# EAGLE schematic GeniusBottom (EAGLE 9.6.2)
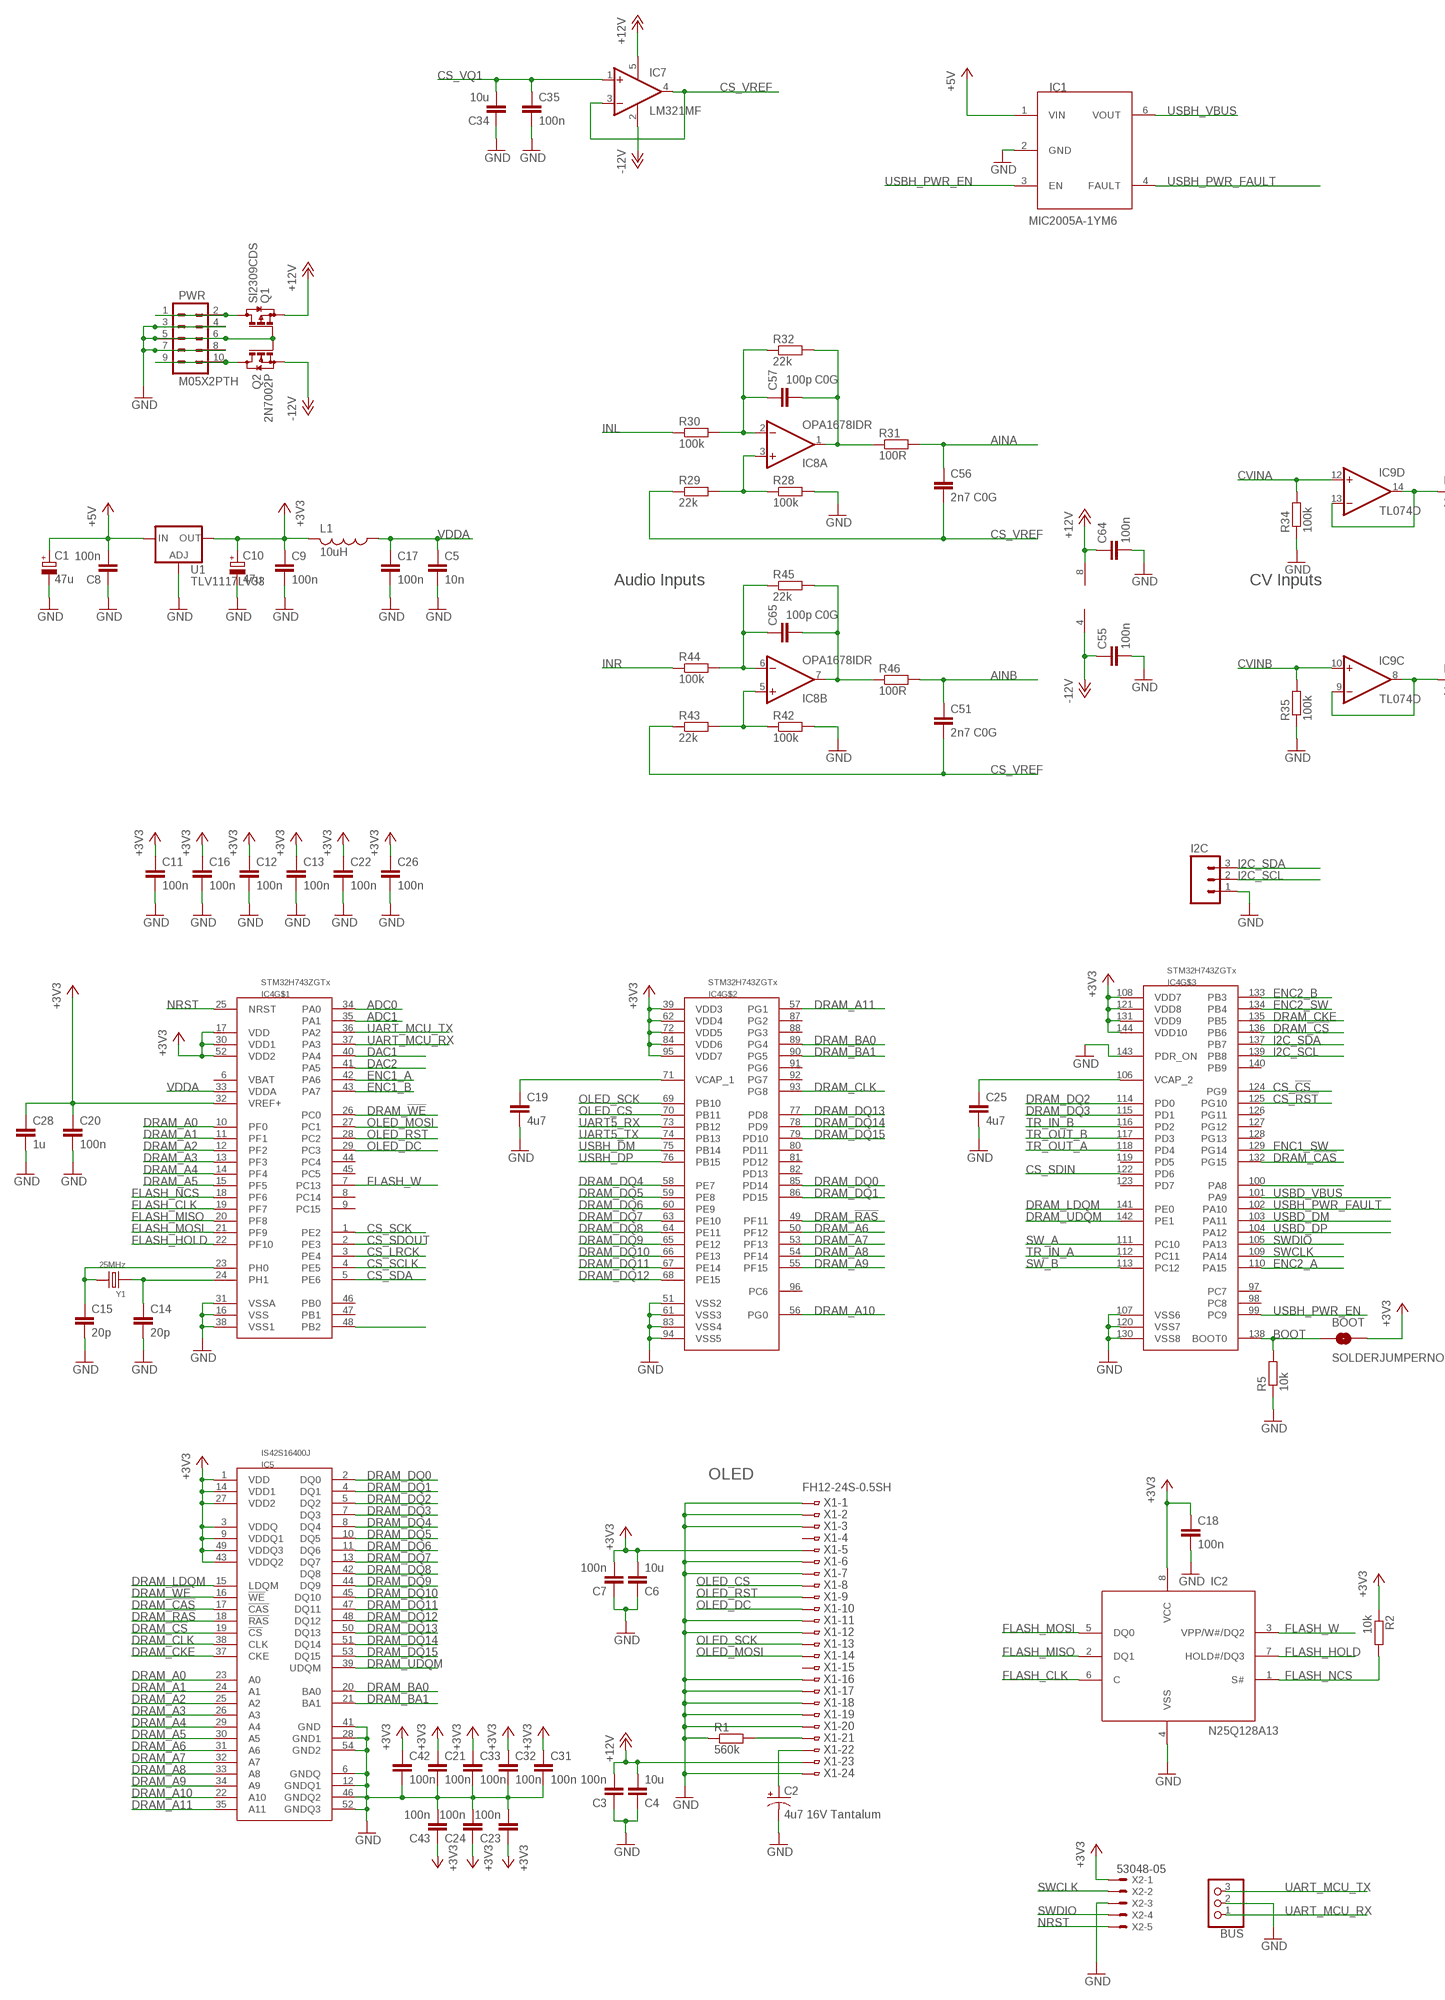
[diagram p0: schematic, sheet 1, part 1 of 2]
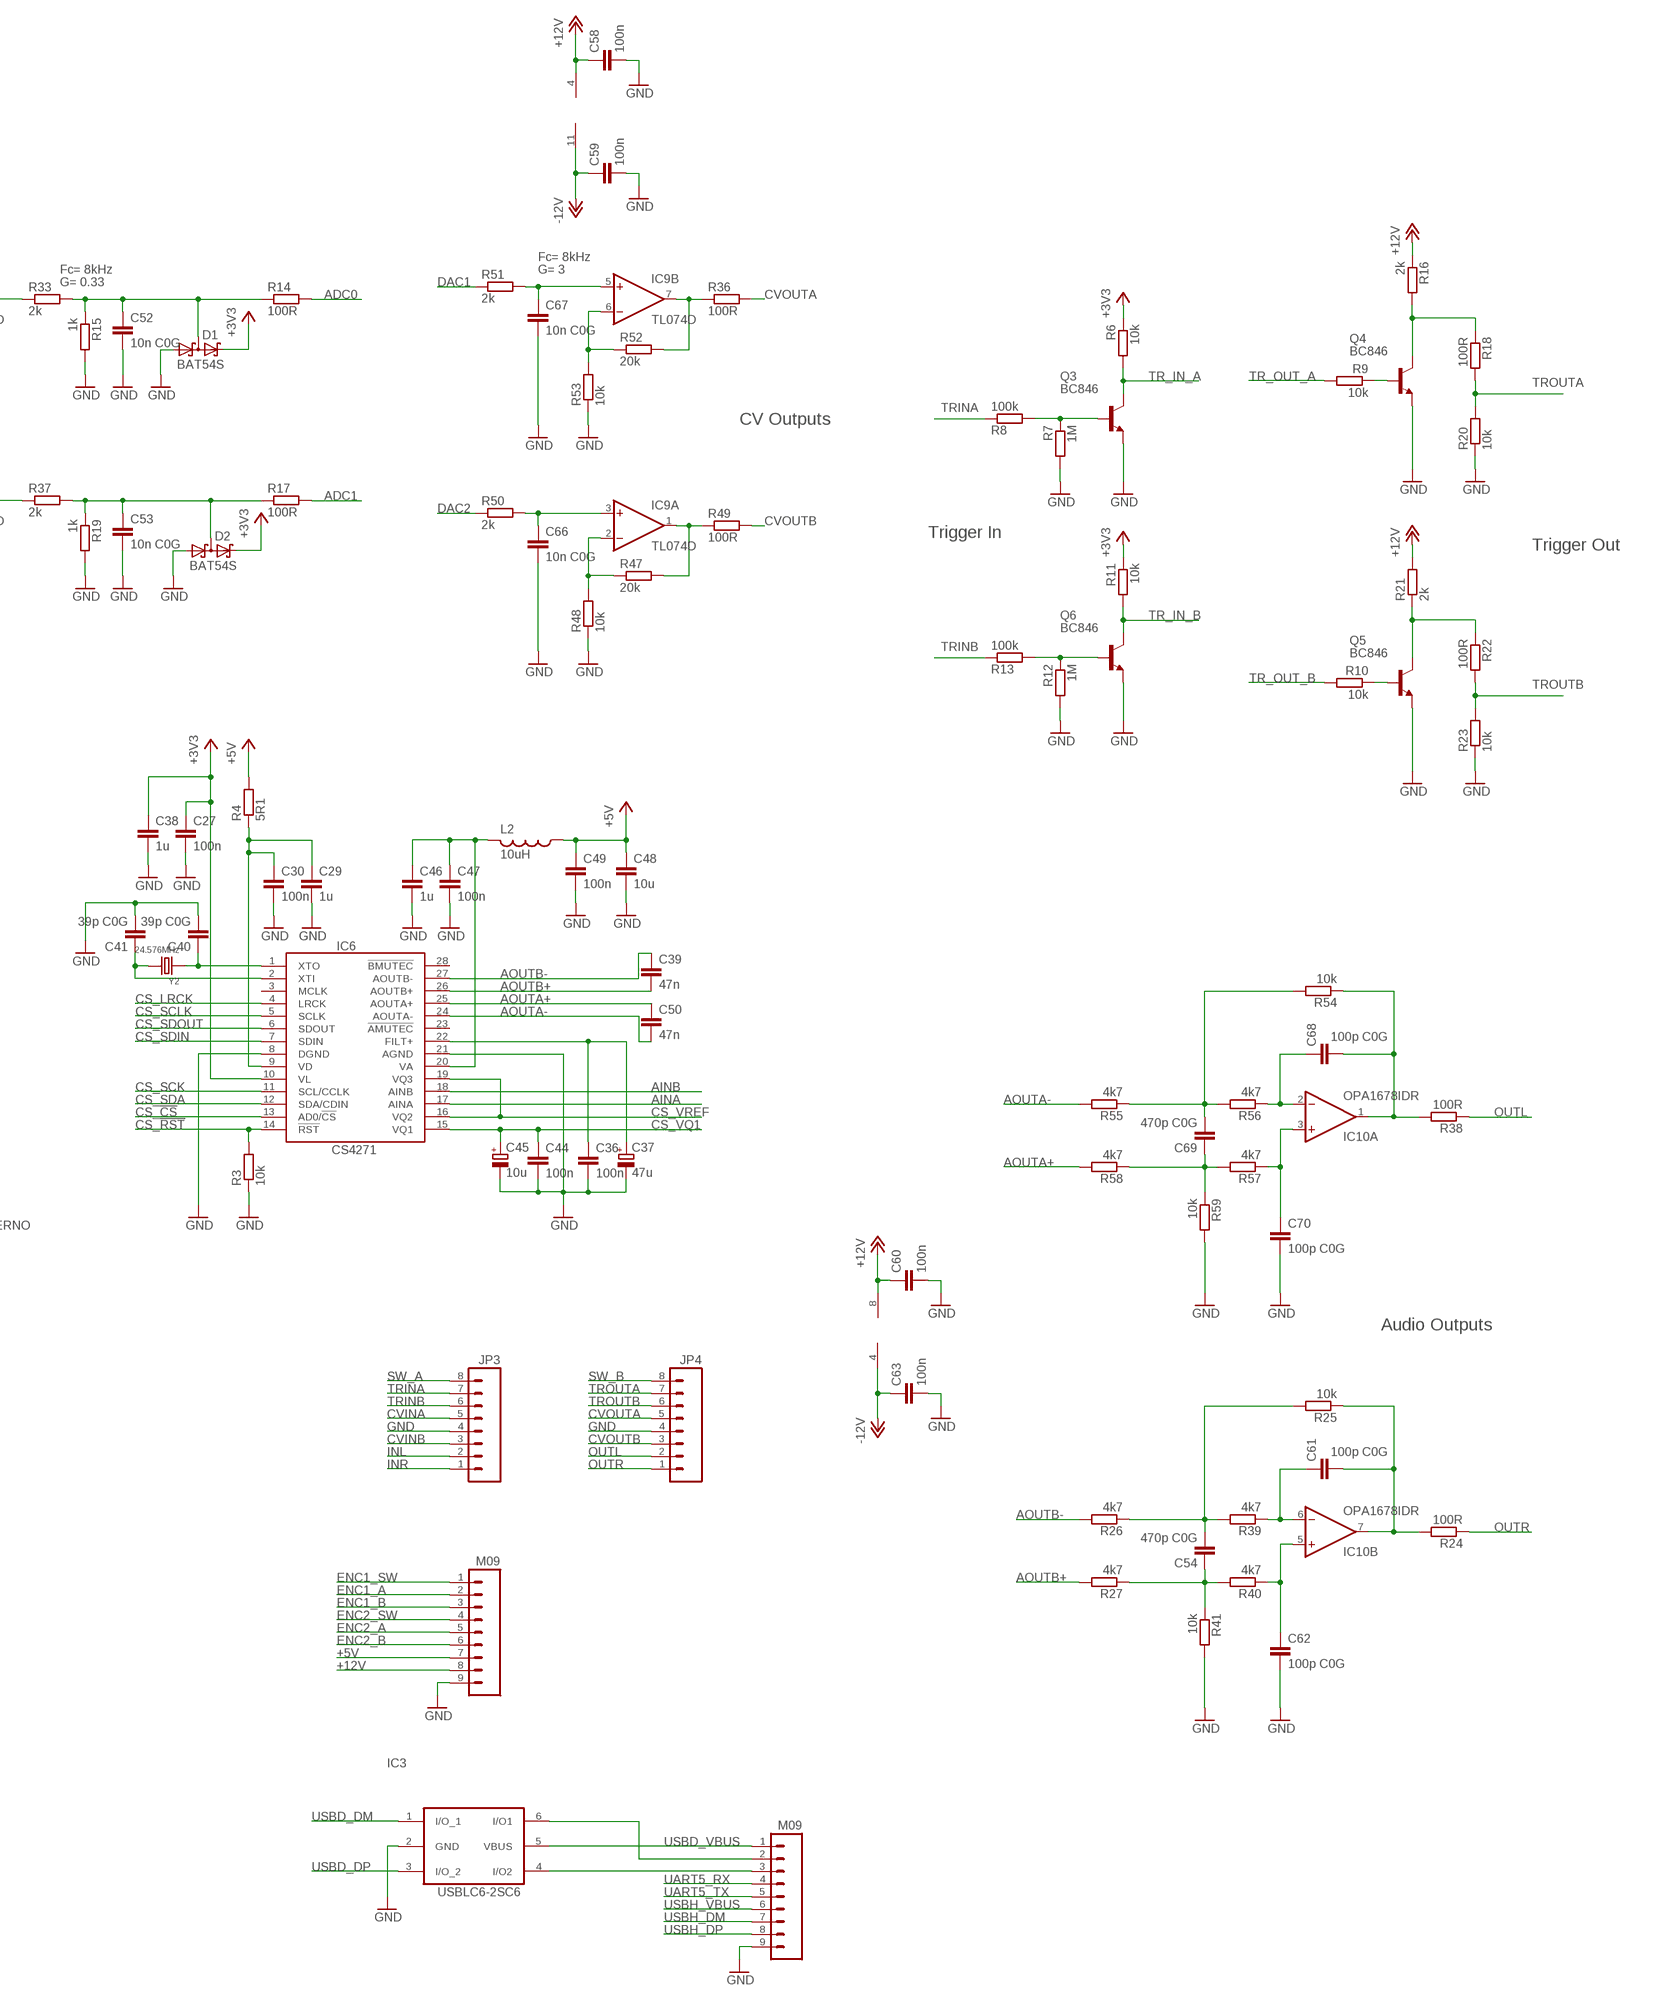
[diagram p1: schematic, sheet 1, part 2 of 2]

## Parts
BOOT  SOLDERJUMPERNO  [SJ_2S-NO]
BUS  CON-JST-1X03PH-TH  [JST-B3B-PH-KL]
C1  47u  CPOL-EU153CLV-0505  [CPOL-5]
C2  4u7 16V Tantalum  CAP_POL1206  [EIA3216]
C3  100n  C-EUC0603  [C0603]
C4  10u  C-EUC1206  [C1206]
C5  10n  C-EUC0603  [C0603]
C6  10u  C-EUC1206  [C1206]
C7  100n  C-EUC0603  [C0603]
C8  100n  C-EUC0603  [C0603]
C9  100n  C-EUC0603  [C0603]
C10  47u  CPOL-EU153CLV-0505  [CPOL-5]
C11  100n  C-EUC0603  [C0603]
C12  100n  C-EUC0603  [C0603]
C13  100n  C-EUC0603  [C0603]
C14  20p  C-EUC0603  [C0603]
C15  20p  C-EUC0603  [C0603]
C16  100n  C-EUC0603  [C0603]
C17  100n  C-EUC0603  [C0603]
C18  100n  C-EUC0603  [C0603]
C19  4u7  C-EUC0603  [C0603]
C20  100n  C-EUC0603  [C0603]
C21  100n  C-EUC0603  [C0603]
C22  100n  C-EUC0603  [C0603]
C23  100n  C-EUC0603  [C0603]
C24  100n  C-EUC0603  [C0603]
C25  4u7  C-EUC0603  [C0603]
C26  100n  C-EUC0603  [C0603]
C27  100n  C-EUC0603  [C0603]
C28  1u  C-EUC0603  [C0603]
C29  1u  C-EUC0603  [C0603]
C30  100n  C-EUC0603  [C0603]
C31  100n  C-EUC0603  [C0603]
C32  100n  C-EUC0603  [C0603]
C33  100n  C-EUC0603  [C0603]
C34  10u  C-EUC1206  [C1206]
C35  100n  C-EUC0603  [C0603]
C36  100n  C-EUC0603  [C0603]
C37  47u  CPOL-EU153CLV-0505  [CPOL-5]
C38  1u  C-EUC0603  [C0603]
C39  47n  C-EUC0603  [C0603]
C40  39p C0G  C-EUC0603  [C0603]
C41  39p C0G  C-EUC0603  [C0603]
C42  100n  C-EUC0603  [C0603]
C43  100n  C-EUC0603  [C0603]
C44  100n  C-EUC0603  [C0603]
C45  10u  CPOL-EU153CLV-0505  [CPOL-5]
C46  1u  C-EUC0603  [C0603]
C47  100n  C-EUC0603  [C0603]
C48  10u  C-EUC1206  [C1206]
C49  100n  C-EUC0603  [C0603]
C50  47n  C-EUC0603  [C0603]
C51  2n7 C0G  C-EUC0603  [C0603]
C52  10n C0G  C-EUC0603  [C0603]
C53  10n C0G  C-EUC0603  [C0603]
C54  470p C0G  C-EUC0603  [C0603]
C55  100n  C-EUC0603  [C0603]
C56  2n7 C0G  C-EUC0603  [C0603]
C57  100p C0G  C-EUC0603  [C0603]
C58  100n  C-EUC0603  [C0603]
C59  100n  C-EUC0603  [C0603]
C60  100n  C-EUC0603  [C0603]
C61  100p C0G  C-EUC0603  [C0603]
C62  100p C0G  C-EUC0603  [C0603]
C63  100n  C-EUC0603  [C0603]
C64  100n  C-EUC0603  [C0603]
C65  100p C0G  C-EUC0603  [C0603]
C66  10n C0G  C-EUC0603  [C0603]
C67  10n C0G  C-EUC0603  [C0603]
C68  100p C0G  C-EUC0603  [C0603]
C69  470p C0G  C-EUC0603  [C0603]
C70  100p C0G  C-EUC0603  [C0603]
D1  BAT54S  [SOT23]
D2  BAT54S  [SOT23]
I2C  M03PTH  [1X03]
IC1  MIC2005A-1YM6  MIC2005  [SOT23-6]
IC2  N25Q128A13  [SO8W]
IC3  USBLC6-2SC6  [SOT-23-6L]
IC4  STM32H743ZGTx  STM32F42XZ/43XZ(144PIN)LQFP144  [QFP50P2200X2200X160-144N]
IC5  IS42S16400J  [TSOP54-400]
IC6  CS4271  [TSSOP28-0.65-9.7X4.4MM]
IC7  LM321MF  [SOT23-5]
IC8  OPA1678IDR  NE5532D  [SO08]
IC9  TL074D  [SO14]
IC10  OPA1678IDR  NE5532D  [SO08]
JP1  M09  [1X09]
JP2  M09  [1X09]
JP3  M081X08  [1X08]
JP4  M081X08  [1X08]
L1  10uH  INDUCTOR  [0603]
L2  10uH  INDUCTOR  [0603]
PWR  M05X2PTH  [AVR_ICSP]
Q1  SI2309CDS  BSS84  [SOT23]
Q2  2N7002P  BSS123  [SOT23]
Q3  BC846  [SOT23]
Q4  BC846  [SOT23]
Q5  BC846  [SOT23]
Q6  BC846  [SOT23]
R1  560k  R-EU_0603  [0603]
R2  10k  R-EU_0603  [0603]
R3  10k  R-EU_0603  [0603]
R4  5R1  R-EU_0603  [0603]
R5  10k  R-EU_0603  [0603]
R6  10k  R-EU_0603  [0603]
R7  1M  R-EU_0603  [0603]
R8  100k  R-EU_0603  [0603]
R9  10k  R-EU_0603  [0603]
R10  10k  R-EU_0603  [0603]
R11  10k  R-EU_0603  [0603]
R12  1M  R-EU_0603  [0603]
R13  100k  R-EU_0603  [0603]
R14  100R  R-EU_0603  [0603]
R15  1k  R-EU_0603  [0603]
R16  2k  R-EU_0603  [0603]
R17  100R  R-EU_0603  [0603]
R18  100R  R-EU_0603  [0603]
R19  1k  R-EU_0603  [0603]
R20  10k  R-EU_0603  [0603]
R21  2k  R-EU_0603  [0603]
R22  100R  R-EU_0603  [0603]
R23  10k  R-EU_0603  [0603]
R24  100R  R-EU_0603  [0603]
R25  10k  R-EU_0603  [0603]
R26  4k7  R-EU_0603  [0603]
R27  4k7  R-EU_0603  [0603]
R28  100k  R-EU_0603  [0603]
R29  22k  R-EU_0603  [0603]
R30  100k  R-EU_0603  [0603]
R31  100R  R-EU_0603  [0603]
R32  22k  R-EU_0603  [0603]
R33  2k  R-EU_0603  [0603]
R34  100k  R-EU_0603  [0603]
R35  100k  R-EU_0603  [0603]
R36  100R  R-EU_0603  [0603]
R37  2k  R-EU_0603  [0603]
R38  100R  R-EU_0603  [0603]
R39  4k7  R-EU_0603  [0603]
R40  4k7  R-EU_0603  [0603]
R41  10k  R-EU_0603  [0603]
R42  100k  R-EU_0603  [0603]
R43  22k  R-EU_0603  [0603]
R44  100k  R-EU_0603  [0603]
R45  22k  R-EU_0603  [0603]
R46  100R  R-EU_0603  [0603]
R47  20k  R-EU_0603  [0603]
R48  10k  R-EU_0603  [0603]
R49  100R  R-EU_0603  [0603]
R50  2k  R-EU_0603  [0603]
R51  2k  R-EU_0603  [0603]
R52  20k  R-EU_0603  [0603]
R53  10k  R-EU_0603  [0603]
R54  10k  R-EU_0603  [0603]
R55  4k7  R-EU_0603  [0603]
R56  4k7  R-EU_0603  [0603]
R57  4k7  R-EU_0603  [0603]
R58  4k7  R-EU_0603  [0603]
R59  10k  R-EU_0603  [0603]
U1  TLV1117LV33  LD117AS33TR  [SOT223]
X1  FH12-24S-0.5SH  [FH12-24S-0.5SH]
X2  53048-05  [53048-05]
Y1  25MHz  SMD-CRYSTAL-8MHZ-20PF-20PPM(2P-5.0X3.2MM)  [X2-SMD-5.0X3.2X1.3MM]
Y2  24.576MHz  SMD-CRYSTAL-8MHZ-20PF-20PPM(2P-5.0X3.2MM)  [X2-SMD-5.0X3.2X1.3MM]

## Nets
+3.3V [power]: BOOT.2 C6.2 C7.2 C9.1 C10.+ C11.1 C12.1 C13.1 C16.1 C18.1 C20.1 C21.1 C22.1 C23.1 C24.1 C26.1 C27.1 C28.1 C31.1 C32.1 C33.1 C38.1 C42.1 C43.1 D1.2(C2) D2.2(C2) IC2.8(VCC) IC4.17(VDD) IC4.30(VDD1) IC4.32(VREF+) IC4.39(VDD3) IC4.52(VDD2) IC4.62(VDD4) IC4.72(VDD5) IC4.84(VDD6) IC4.95(VDD7) IC4.108(VDD7) IC4.121(VDD8) IC4.131(VDD9) IC4.144(VDD10) IC5.1(VDD) IC5.3(VDDQ) IC5.9(VDDQ1) IC5.14(VDD1) IC5.27(VDD2) IC5.43(VDDQ2) IC5.49(VDDQ3) IC6.10(VL) L1.2 R2.1 R6.1 R11.1 U1.4(OUT) X1.5 X2.1 ; supply symbol labelled +3V3
+5V [power]: C1.+ C8.2 C48.1 C49.1 IC1.1(VIN) JP2.7 L2.1 R4.2 U1.3(IN)
+12V: C3.2 C4.2 C58.1 C60.1 C64.1 IC7.5(V+) IC8.8(P:V+) IC9.4(P:V+) IC10.8(P:V+) JP2.8 Q1.2(S) R16.1 R21.2 X1.23
-12V: C55.1 C59.1 C63.1 IC7.2(V-) IC8.4(P:V-) IC9.11(P:V-) IC10.4(P:V-) Q2.2(S)
ADC0: IC4.34(PA0) R14.2
ADC1: IC4.35(PA1) R17.2
AINA: C56.1 IC6.17(AINA) R31.2
AINB: C51.1 IC6.18(AINB) R46.2
ANALOG_OUTA: C68.2 IC10.1(A:OUT) R38.2 R54.1
ANALOG_OUTB: C61.2 IC10.7(B:OUT) R24.2 R25.1
AOUTA+: C50.1 IC6.25(AOUTA+) R58.2
AOUTA-: C50.2 IC6.24(AOUTA-) R55.2
AOUTB+: C39.2 IC6.26(AOUTB+) R27.2
AOUTB-: C39.1 IC6.27(AOUTB-) R26.2
BOOT: BOOT.1 IC4.138(BOOT0) R5.2
CS_!CS: IC4.124(PG9) IC6.13(AD0/!CS)
CS_!RST: IC4.125(PG10) IC6.14(!RST) R3.2
CS_LRCK: IC4.3(PE4) IC6.4(LRCK)
CS_SCK: IC4.1(PE2) IC6.11(SCL/CCLK)
CS_SCLK: IC4.4(PE5) IC6.5(SCLK)
CS_SDA: IC4.5(PE6) IC6.12(SDA/CDIN)
CS_SDIN: IC4.122(PD6) IC6.7(SDIN)
CS_SDOUT: IC4.2(PE3) IC6.6(SDOUT)
CS_VQ1: C34.2 C35.1 C44.1 C45.+ IC6.15(VQ1) IC7.1(+IN)
CS_VREF: C51.2 C56.2 IC6.16(VQ2) IC6.19(VQ3) IC7.3(-IN) IC7.4(OUT) R29.1 R43.1
CVINA: IC9.12(D:+IN) JP3.5 R34.2
CVINB: IC9.10(C:+IN) JP3.3 R35.2
CVOUTA: JP4.5 R36.2
CVOUTB: JP4.3 R49.2
DAC1: IC4.40(PA4) R51.1
DAC2: IC4.41(PA5) R50.1
DRAM_!CAS: IC4.132(PG15) IC5.17(!CAS)
DRAM_!CS: IC4.136(PB6) IC5.19(!CS)
DRAM_!RAS: IC4.49(PF11) IC5.18(!RAS)
DRAM_!WE: IC4.26(PC0) IC5.16(!WE)
DRAM_A0: IC4.10(PF0) IC5.23(A0)
DRAM_A1: IC4.11(PF1) IC5.24(A1)
DRAM_A2: IC4.12(PF2) IC5.25(A2)
DRAM_A3: IC4.13(PF3) IC5.26(A3)
DRAM_A4: IC4.14(PF4) IC5.29(A4)
DRAM_A5: IC4.15(PF5) IC5.30(A5)
DRAM_A6: IC4.50(PF12) IC5.31(A6)
DRAM_A7: IC4.53(PF13) IC5.32(A7)
DRAM_A8: IC4.54(PF14) IC5.33(A8)
DRAM_A9: IC4.55(PF15) IC5.34(A9)
DRAM_A10: IC4.56(PG0) IC5.22(A10)
DRAM_A11: IC4.57(PG1) IC5.35(A11)
DRAM_BA0: IC4.89(PG4) IC5.20(BA0)
DRAM_BA1: IC4.90(PG5) IC5.21(BA1)
DRAM_CKE: IC4.135(PB5) IC5.37(CKE)
DRAM_CLK: IC4.93(PG8) IC5.38(CLK)
DRAM_DQ0: IC4.85(PD14) IC5.2(DQ0)
DRAM_DQ1: IC4.86(PD15) IC5.4(DQ1)
DRAM_DQ2: IC4.114(PD0) IC5.5(DQ2)
DRAM_DQ3: IC4.115(PD1) IC5.7(DQ3)
DRAM_DQ4: IC4.58(PE7) IC5.8(DQ4)
DRAM_DQ5: IC4.59(PE8) IC5.10(DQ5)
DRAM_DQ6: IC4.60(PE9) IC5.11(DQ6)
DRAM_DQ7: IC4.63(PE10) IC5.13(DQ7)
DRAM_DQ8: IC4.64(PE11) IC5.42(DQ8)
DRAM_DQ9: IC4.65(PE12) IC5.44(DQ9)
DRAM_DQ10: IC4.66(PE13) IC5.45(DQ10)
DRAM_DQ11: IC4.67(PE14) IC5.47(DQ11)
DRAM_DQ12: IC4.68(PE15) IC5.48(DQ12)
DRAM_DQ13: IC4.77(PD8) IC5.50(DQ13)
DRAM_DQ14: IC4.78(PD9) IC5.51(DQ14)
DRAM_DQ15: IC4.79(PD10) IC5.53(DQ15)
DRAM_LDQM: IC4.141(PE0) IC5.15(LDQM)
DRAM_UDQM: IC4.142(PE1) IC5.39(UDQM)
ENC1_A: IC4.42(PA6) JP2.2
ENC1_B: IC4.43(PA7) JP2.3
ENC1_SW: IC4.129(PG14) JP2.1
ENC2_A: IC4.110(PA15) JP2.5
ENC2_B: IC4.133(PB3) JP2.6
ENC2_SW: IC4.134(PB4) JP2.4
FLASH_CLK: IC2.6(C) IC4.19(PF7)
FLASH_HOLD: IC2.7(HOLD#/DQ3) IC4.22(PF10)
FLASH_MISO: IC2.2(DQ1) IC4.20(PF8)
FLASH_MOSI: IC2.5(DQ0) IC4.21(PF9)
FLASH_NCS: IC2.1(S#) IC4.18(PF6) R2.2
FLASH_W: IC2.3(VPP/W#/DQ2) IC4.7(PC13)
GND: BUS.2 C1.- C2.C(-) C3.1 C4.1 C5.2 C6.1 C7.1 C8.1 C9.2 C10.- C11.2 C12.2 C13.2 C14.2 C15.2 C16.2 C17.2 C18.2 C19.2 C20.2 C21.2 C22.2 C23.2 C24.2 C25.2 C26.2 C27.2 C28.2 C29.2 C30.2 C31.2 C32.2 C33.2 C34.1 C35.2 C36.2 C37.- C38.2 C40.2 C41.2 C42.2 C43.2 C44.2 C45.- C46.2 C47.2 C48.2 C49.2 C52.2 C53.2 C55.2 C58.2 C59.2 C60.2 C62.2 C63.2 C64.2 C66.2 C67.2 C70.2 D1.1(A1) D2.1(A1) I2C.1 IC1.2(GND) IC2.4(VSS) IC3.2(GND) IC4.16(VSS) IC4.31(VSSA) IC4.38(VSS1) IC4.51(VSS2) IC4.61(VSS3) IC4.83(VSS4) IC4.94(VSS5) IC4.107(VSS6) IC4.120(VSS7) IC4.130(VSS8) IC4.143(PDR_ON) IC5.6(GNDQ) IC5.12(GNDQ1) IC5.28(GND1) IC5.41(GND) IC5.46(GNDQ2) IC5.52(GNDQ3) IC5.54(GND2) IC6.8(DGND) IC6.21(AGND) JP1.9 JP2.9 JP3.4 JP4.4 PWR.3 PWR.4 PWR.5 PWR.6 PWR.7 PWR.8 Q1.1(G) Q2.1(G) Q3.2(E) Q4.2(E) Q5.2(E) Q6.2(E) R1.1 R3.1 R5.1 R7.2 R12.2 R15.2 R19.2 R20.1 R23.1 R28.2 R34.1 R35.1 R41.2 R42.2 R48.1 R53.1 R59.2 U1.1(ADJ) X1.1 X1.2 X1.3 X1.6 X1.7 X1.11 X1.12 X1.16 X1.17 X1.18 X1.19 X1.20 X1.24 X2.3
I2C_SCL: I2C.2 IC4.139(PB8)
I2C_SDA: I2C.3 IC4.137(PB7)
INL: JP3.2 R30.1
INR: JP3.1 R44.1
N$1: C69.1 R57.2 R58.1 R59.1
N$2: C52.1 D1.3(C1A2) R14.1 R15.1 R33.2
N$3: C46.1 C47.1 IC6.20(VA) L2.2
N$4: IC9.7(B:OUT) R36.1 R52.2
N$5: IC9.8(C:OUT) IC9.9(C:-IN) R37.1
N$6: C2.A(+) X1.22
N$7: PWR.9 PWR.10 Q2.3(D)
N$8: R1.2 X1.21
N$9: PWR.1 PWR.2 Q1.3(D)
N$10: C69.2 R54.2 R55.1 R56.2
N$11: C14.1 IC4.24(PH1) Y1.1
N$12: IC9.2(A:-IN) R47.1 R48.2
N$13: C68.1 IC10.2(A:-IN) R56.1
N$14: C70.1 IC10.3(A:+IN) R57.1
N$15: IC9.6(B:-IN) R52.1 R53.2
N$17: C15.1 IC4.23(PH0) Y1.2
N$18: C40.1 IC6.1(XTO) Y2.1
N$19: IC3.6(I/O1) JP1.2
N$20: C36.1 C37.+ IC6.22(FILT+)
N$21: C41.1 IC6.2(XTI) Y2.2
N$22: C53.1 D2.3(C1A2) R17.1 R19.1 R37.2
N$25: C54.1 R27.1 R40.2 R41.1
N$26: C54.2 R25.2 R26.1 R39.2
N$27: C61.1 IC10.6(B:-IN) R39.1
N$28: C62.1 IC10.5(B:+IN) R40.1
N$30: IC9.13(D:-IN) IC9.14(D:OUT) R33.1
N$31: C66.1 IC9.3(A:+IN) R50.2
N$32: IC9.1(A:OUT) R47.2 R49.1
N$33: C25.1 IC4.106(VCAP_2)
N$34: C19.1 IC4.71(VCAP_1)
N$36: IC8.3(A:+IN) R28.1 R29.2
N$37: Q6.1(B) R12.1 R13.2
N$38: C57.1 IC8.2(A:-IN) R30.2 R32.1
N$39: Q5.1(B) R10.1
N$40: C57.2 IC8.1(A:OUT) R31.1 R32.2
N$41: Q5.3(C) R21.1 R22.1
N$42: IC8.5(B:+IN) R42.1 R43.2
N$43: C65.1 IC8.6(B:-IN) R44.2 R45.1
N$44: C67.1 IC9.5(B:+IN) R51.2
N$45: C65.2 IC8.7(B:OUT) R45.2 R46.1
N$46: IC4.48(PB2)
N$47: Q4.1(B) R9.1
N$48: IC4.100(PA8)
N$51: Q4.3(C) R16.2 R18.1
N$54: Q3.1(B) R7.1 R8.2
N$55: IC3.4(I/O2) JP1.3
NRST: IC4.25(NRST) X2.5
OLED_CS: IC4.70(PB11) X1.8
OLED_DC: IC4.29(PC3) X1.10
OLED_MOSI: IC4.27(PC1) X1.14
OLED_RST: IC4.28(PC2) X1.9
OLED_SCK: IC4.69(PB10) X1.13
OUTL: JP4.2 R38.1
OUTR: JP4.1 R24.1
SW_A: IC4.111(PC10) JP3.8
SW_B: IC4.113(PC12) JP4.8
SWCLK: IC4.109(PA14) X2.2
SWDIO: IC4.105(PA13) X2.4
TR_IN_A: IC4.112(PC11) Q3.3(C) R6.2
TR_IN_B: IC4.116(PD2) Q6.3(C) R11.2
TR_OUT_A: IC4.118(PD4) R9.2
TR_OUT_B: IC4.117(PD3) R10.2
TRINA: JP3.7 R8.1
TRINB: JP3.6 R13.1
TROUTA: JP4.7 R18.2 R20.2
TROUTB: JP4.6 R22.2 R23.2
UART5_RX: IC4.73(PB12) JP1.4
UART5_TX: IC4.74(PB13) JP1.5
UART_MCU_RX: BUS.1 IC4.37(PA3)
UART_MCU_TX: BUS.3 IC4.36(PA2)
USBD_DM: IC3.1(I/O_1) IC4.103(PA11)
USBD_DP: IC3.3(I/O_2) IC4.104(PA12)
USBD_VBUS: IC3.5(VBUS) IC4.101(PA9) JP1.1
USBH_DM: IC4.75(PB14) JP1.7
USBH_DP: IC4.76(PB15) JP1.8
USBH_PWR_EN: IC1.3(EN) IC4.99(PC9)
USBH_PWR_FAULT: IC1.4(FAULT) IC4.102(PA10)
USBH_VBUS: IC1.6(VOUT) JP1.6
VD: C29.1 C30.1 IC6.9(VD) R4.1
VDDA: C5.1 C17.1 IC4.33(VDDA) L1.1
Unconnected: IC4.6(VBAT) IC4.8(PC14) IC4.9(PC15) IC4.44(PC4) IC4.45(PC5) IC4.46(PB0) IC4.47(PB1) IC4.80(PD11) IC4.81(PD12) IC4.82(PD13) IC4.87(PG2) IC4.88(PG3) IC4.91(PG6) IC4.92(PG7) IC4.96(PC6) IC4.97(PC7) IC4.98(PC8) IC4.119(PD5) IC4.123(PD7) IC4.126(PG11) IC4.127(PG12) IC4.128(PG13) IC4.140(PB9) IC6.3(MCLK) IC6.23(!AMUTEC) IC6.28(!BMUTEC) X1.4 X1.15

## Notes on the sheet
- Fc= 8kHz
- Fc= 8kHz | G= 3
- G= 0.33
- Audio Inputs | CV Inputs
- CV Outputs
- Trigger In
- Trigger Out
- Audio Outputs
- OLED

## Library data of the parts
BOOT = SparkFun:SOLDERJUMPER: Solder Jumper Standard SMD solder jumper. Used to automate production. Two varients : Normally Open and Normally Closed are the same, but have different paste layers. NC will have a large amount of paste and should jumper during reflow.
BUS = Rebel:CON-JST-1X03
C1 C10 C37 C45 = Rebel:CPOL-EU: POLARIZED CAPACITOR, European symbol
C2 = smartplug:CAP_POL: Capacitor Polarized These are standard SMD and PTH capacitors. Normally 10uF, 47uF, and 100uF in electrolytic and tantalum varieties. Always verify the external diameter of the through hole cap, it varies with capacity, voltage, and manufacturer. The EIA devices should be standard.
C3-C9 C11-C36 C38-C44 C46-C70 = Rebel:C-EU: CAPACITOR, European symbol
D1 D2 = diode:BAT54S: Schottky Diodes Pin connection corrected 2011-05-04 Source: Fairchild .. BAT54.pdf
I2C = SparkFun:M03: Header 3 Standard 3-pin 0.1" header. Use with straight break away headers (SKU : PRT-00116), right angle break away headers (PRT-00553), swiss pins (PRT-00743), machine pins (PRT-00117), and female headers (PRT-00115). Molex polarized connector foot print use with SKU : PRT-08232 with associated crimp pins and housings.
IC1 = James:MIC2005; OC_FARNELL: 2509882
IC2 = Rebel:N25Q128A13: N25Q128A13 Flash Memory SO8W; OC_FARNELL: 2253682
IC3 = usblc6:USBLC6-2: VERY LOW CAPACITANCE ESD PROTECTION 2 line Datasheet link <http://www.st.com/web/catalog/sense_power/FM114/CL1137/SC1489/PF93353>
IC4 = Rebel:STM32F42XZ/43XZ(144PIN); OC_FARNELL: 2484975
IC5 = James:IS42S16400J; OC_FARNELL: 2253831
IC6 = Rebel:CS4271
IC7 = linear:LM321?*: Low Power Single Op Amp Source: http://cache.national.com/ds/LM/LM321.pdf
IC8 IC10 = linear:NE5532: AUDIO AMPLIFIER
IC9 = linear:TL074: OP AMP
JP1 JP2 = SparkFun:M09: Header 9 Standard 9-pin 0.1" header. Use with straight break away headers (SKU : PRT-00116), right angle break away headers (PRT-00553), swiss pins (PRT-00743), machine pins (PRT-00117), and female headers (PRT-00115).
JP3 JP4 = SparkFun:M08: Header 8 Standard 8-pin 0.1" header. Use with straight break away headers (SKU : PRT-00116), right angle break away headers (PRT-00553), swiss pins (PRT-00743), machine pins (PRT-00117), and female headers (PRT-00115).
L1 L2 = Rebel:INDUCTOR; OC_FARNELL: 2288736
PWR = SparkFun:M05X2: Header 5x2 Standard 10-pin dual row 0.1" header. Commonly used with AVR-ISP. Use with Spark Fun Electronics SKU: PRT-00778
Q1 = transistor-small-signal:BSS84: P-CHANNEL MOS FET; OC_FARNELL: 1779264
Q2 = transistor-small-signal:BSS123: N-CHANNEL MOS FET; OC_FARNELL: 1843725
Q3-Q6 = transistor:BC846: NPN TRANSISTOR
R1-R59 = Rebel:R-EU_: RESISTOR, European symbol
U1 = v-reg:LD117A?*: Low drop fixed and adjustable positive voltage regulators 1 A Source: http://www.st.com/stonline/products/literature/ds/7194/ld1117axx.pdf; OC_FARNELL: 1469104
X1 = con-hirose:FH12-24S-0.5S: 0.5mm Pitch Connectors For FPC/FFC Source: Data sheet <http://www.hirose.co.jp/cataloge_hp/e58605370.pdf>; MPN: FH12-24S-0.5SH(55); OC_FARNELL: 1324552; OC_NEWARK: 34M6170
X2 = con-molex:53?-05: CONNECTOR wire to board 1.25 mm (.049 inch) pitch header; MF: MOLEX; MPN: 53048-0510; OC_FARNELL: 9732926; OC_NEWARK: 57H4722
Y1 Y2 = Seeed-OPL-crystal-osctllator:SMD-CRYSTAL-8MHZ-20PF-20PPM(2P-5.0X3.2MM): 306010004; MPN: 5032/2P; VALUE: 5032/2p

## Net classes
1 power: width 0.178 mm, drill 0.305 mm, clearance 0.178 mm to class 0, clearance 0.178 mm